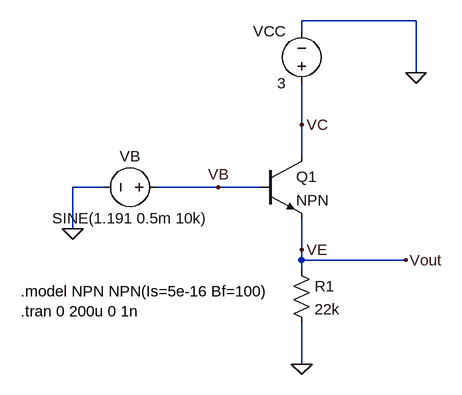
[diagram p0: schematic draft2.asc]
draft2.asc, the LTspice schematic file:
Version 4
SHEET 1 880 680
WIRE 608 80 432 80
WIRE 432 96 432 80
WIRE 608 160 608 80
WIRE 432 240 432 176
WIRE 432 288 432 240
WIRE 128 336 80 336
WIRE 304 336 208 336
WIRE 368 336 304 336
WIRE 80 400 80 336
WIRE 432 432 432 384
WIRE 432 448 432 432
WIRE 592 448 432 448
WIRE 432 464 432 448
WIRE 432 608 432 544
FLAG 80 400 0
FLAG 432 608 0
FLAG 608 160 0
FLAG 304 336 VB
FLAG 432 432 VE
FLAG 432 240 VC
FLAG 592 448 Vout
SYMBOL npn 368 288 R0
SYMATTR InstName Q1
SYMBOL Res 416 448 R0
SYMATTR InstName R1
SYMATTR Value 22k
SYMBOL Voltage 432 192 R180
WINDOW 0 24 96 Left 2
WINDOW 3 24 16 Left 2
SYMATTR InstName VCC
SYMATTR Value 3
SYMBOL Voltage 224 336 R90
WINDOW 0 -32 56 VBottom 2
WINDOW 3 32 56 VTop 2
SYMATTR InstName VB
SYMATTR Value SINE(1.191 0.5m 10k)
TEXT 0 496 Left 2 !.model NPN NPN(Is=5e-16 Bf=100)\n.tran 0 200u 0 1n

The netlist it stands for:
* draft2.asc
Q1 VC VB Vout 0 NPN
R1 Vout 0 22k
VCC VC 0 3
VB VB 0 SINE(1.191 0.5m 10k)
.model NPN NPN
.model PNP PNP
.lib standard.bjt
.model NPN NPN(Is=5e-16 Bf=100)
.tran 0 200u 0 1n
.backanno
.end